# Altium project 抗干扰能力强的红外传感器.PrjPCB
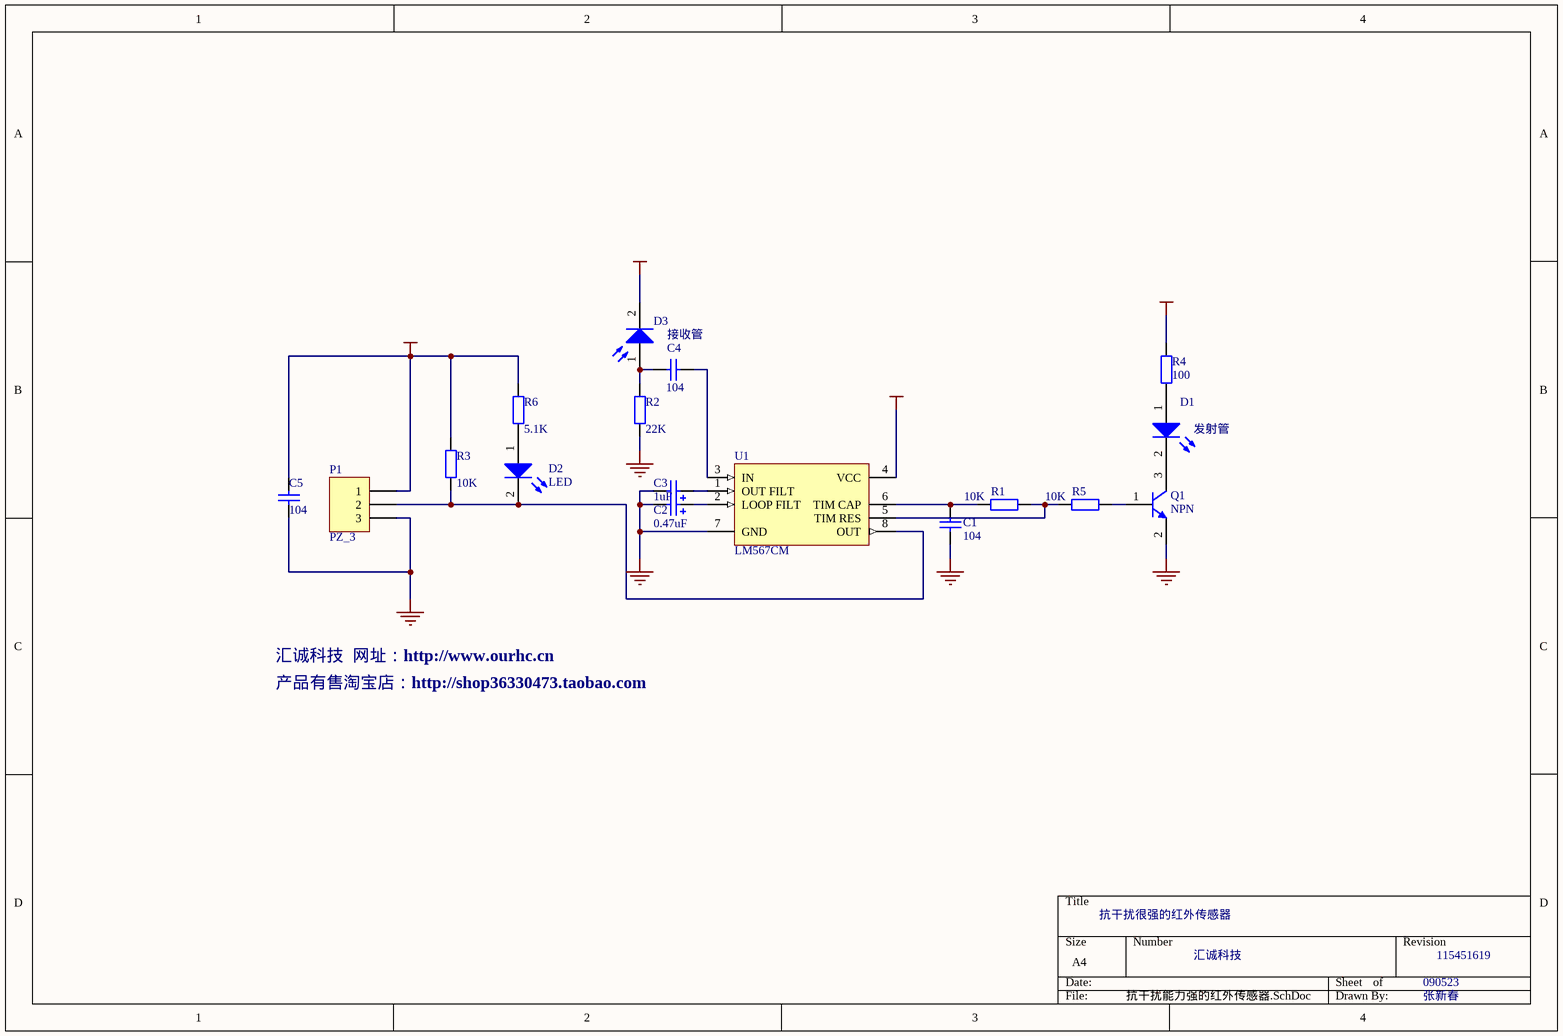
[diagram p0: 抗干扰能力强的红外传感器.SchDoc]
1 sheet, 17 parts. Net scope: global (net labels, ports and power ports of the same name join across sheets).
Board file: 红外传感器_new.PcbDoc

## Sheet 抗干扰能力强的红外传感器.SchDoc
size A4

### Parts
C1  value 104  [TP-0805-R]
C2  value 0.47uF  [DJDR_4mm]
C3  value 1uF  [DJDR_4mm]
C4  value 104  [TP-0805-R]
C5  value 104  [TP-0805-R]
D1  发射管  [CPDR]
D2  LED  [CPDR]
D3  接收管  [CPDR]
P1  PZ_3  [HDR-3]
Q1  NPN  [SO-G3]
R1  value 10K  [TP-0805-R]
R2  value 22K  [TP-0805-R]
R3  value 10K  [TP-0805-R]
R4  value 100  [TP-0805-R]
R5  value 10K  [TP-0805-R]
R6  value 5.1K  [TP-0805-R]
U1  LM567CM  [M08A]

### Nets
GND: C1.2 C2.2 C3.2 C5.1 P1.3 Q1.2(E) R2.1 U1.7(GND)
VCC: C5.2 D3.2(K) P1.1 R3.2 R4.1 R6.2 U1.4(VCC)
NetC1_1: C1.1 R1.2 U1.6(TIM_CAP)
NetC2_1: C2.1 U1.2(LOOP_FILT)
NetC3_1: C3.1 U1.1(OUT_FILT)
NetC4_1: C4.1 U1.3(IN)
NetC4_2: C4.2 D3.1(A) R2.2
NetD1_1: D1.1(A) R4.2
NetD1_2: D1.2(K) Q1.3(C)
NetD2_1: D2.1(A) R6.1
NetD2_2: D2.2(K) P1.2 R3.1 U1.8(OUT)
NetQ1_1: Q1.1(B) R5.1
NetR1_1: R1.1 R5.2 U1.5(TIM_RES)

### Notes on the sheet
- 汇诚科技  网址：http://www.ourhc.cn
- 产品有售淘宝店：http://shop36330473.taobao.com
- 抗干扰很强的红外传感器
- 汇诚科技
- 090523
- 115451619
- 张新春

### Library data of the parts
C1 C4 C5 = CPDR: 瓷片电容; Published: 8-Jun-2000; LatestRevisionDate: 17-Jul-2002; LatestRevisionNote: Re-released for DXP Platform.; Publisher: Altium Limited
C2 C3 = DJDR: 电解电容; Published: 8-Jun-2000; LatestRevisionDate: 17-Jul-2002; LatestRevisionNote: Re-released for DXP Platform.; Publisher: Altium Limited
D1 D2 = LED: 发光二极管; Published: 8-Jun-2000; LatestRevisionDate: 17-Jul-2002; LatestRevisionNote: Re-released for DXP Platform.; Publisher: Altium Limited
D3 = JS2JG: 接收二极管; Published: 24-Mar-1999; LatestRevisionDate: 17-Jul-2002; LatestRevisionNote: Re-released for DXP Platform.; Publisher: Altium Limited
P1 = PZ_3: 排针——3; LatestRevisionDate: 17-Jul-2002; LatestRevisionNote: Re-released for DXP Platform.; Publisher: Altium Limited
Q1 = TPSJG_NPN: 贴片三极管——NPN; Published: 8-Jun-2000; LatestRevisionDate: 15-Jan-2003; LatestRevisionNote: PCB Footprint 'BCY-W3/D4.7' replaced; DatasheetDocument: 1997; PackageReference: TO-92A; Publisher: Altium Limited; Code_JEDEC: TO-92A
R1-R6 = Res: 电阻; Published: 8-Jun-2000; LatestRevisionDate: 17-Jul-2002; LatestRevisionNote: Re-released for DXP Platform.; Publisher: Altium Limited
U1 = LM567CM: Tone Decoder; Published: 15-Apr-2002; LatestRevisionDate: 6-Jun-2005; LatestRevisionNote: Stylized 3D Model Added.; DatasheetDocument: May-1999; PackageDocument: Sep-1997; PackageReference: M08A; Publisher: Altium Limited; Code_JEDEC: MS-012-AA; Code_IPC: SO8; ComponentLink1Description: Manufacturer Link; ComponentLink1URL: http://www.national.com/